# Altium schematic sheet MX.SchDoc
size A; SheetNumber: 4; SheetTotal: 7
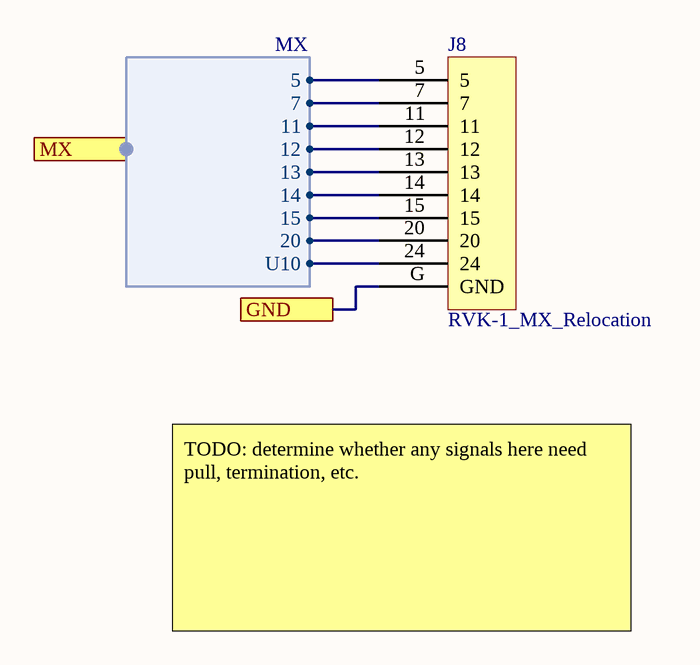
[diagram p0: MX.SchDoc]

## Parts
J8  RVK-1_MX_Relocation  [RVK-1_MX]

## Ports
GND, MX (harness MX)

## Harnesses
MX: 5, 7, 11, 12, 13, 14, 15, 20, U10

## Nets
GND: J8.G(GND) ; port GND
NetJ8_5: J8.5 ; port MX.5
NetJ8_7: J8.7 ; port MX.7
NetJ8_11: J8.11 ; port MX.11
NetJ8_12: J8.12 ; port MX.12
NetJ8_13: J8.13 ; port MX.13
NetJ8_14: J8.14 ; port MX.14
NetJ8_15: J8.15 ; port MX.15
NetJ8_20: J8.20 ; port MX.20
NetJ8_24: J8.24 ; port MX.U10

## Notes on the sheet
- TODO: determine whether any signals here need pull, termination, etc.